# EAGLE design dabpi+_v1 (EAGLE 6.6.0)
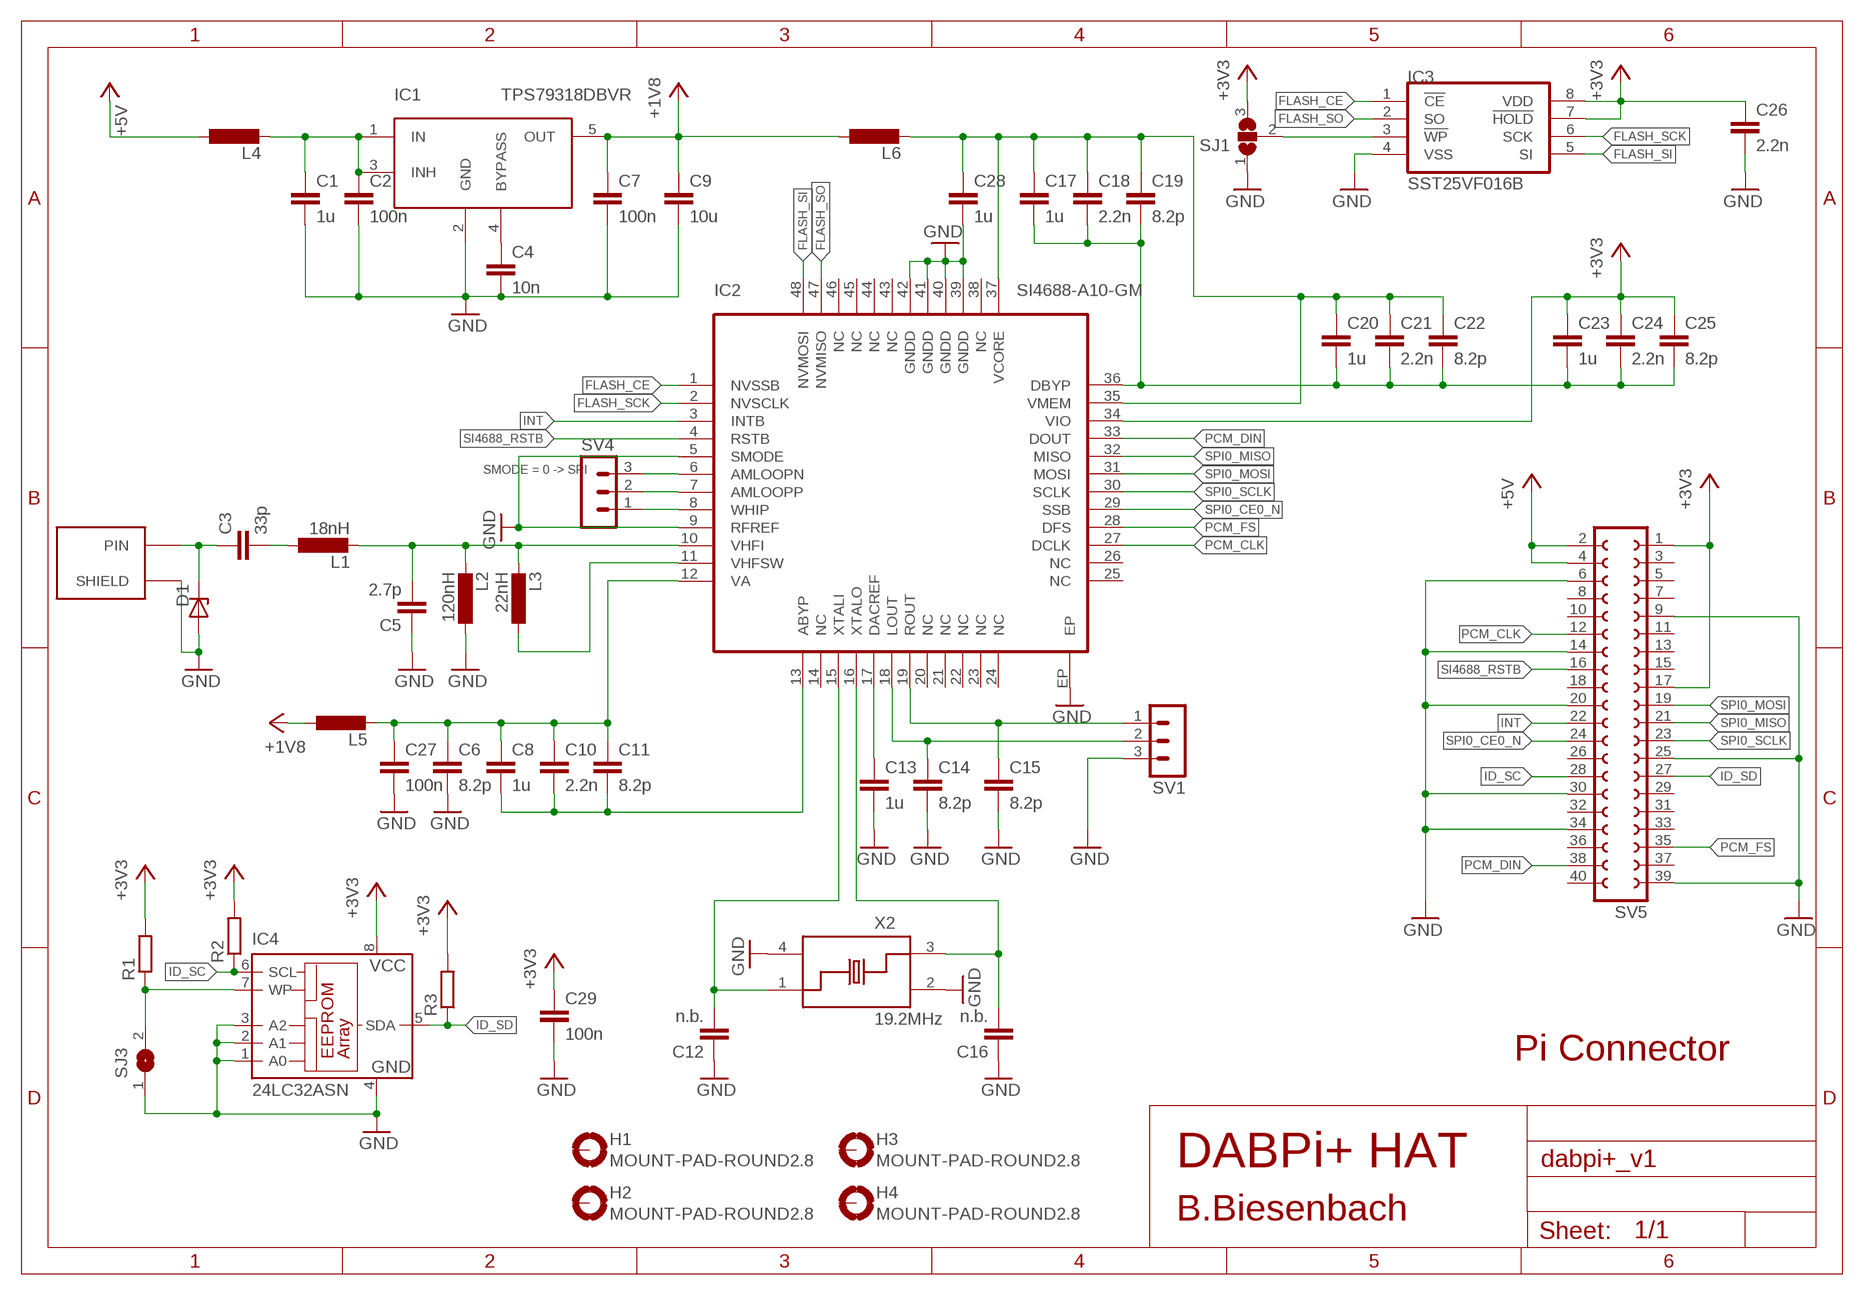
[diagram p0: schematic, sheet 1]

## Parts
C1  1u  C0603  [SMD0603]
C2  100n  C0603  [SMD0603]
C3  33p  C0402  [SMD0402]
C4  10n  C0603  [SMD0603]
C5  2.7p  C0402  [SMD0402]
C6  8.2p  C0603  [SMD0603]
C7  100n  C0603  [SMD0603]
C8  1u  C0603  [SMD0603]
C9  10u  C0603  [SMD0603]
C10  2.2n  C0603  [SMD0603]
C11  8.2p  C0603  [SMD0603]
C12  n.b.  C0402  [SMD0402]
C13  1u  C0603  [SMD0603]
C14  8.2p  C0603  [SMD0603]
C15  8.2p  C0603  [SMD0603]
C16  n.b.  C0402  [SMD0402]
C17  1u  C0603  [SMD0603]
C18  2.2n  C0603  [SMD0603]
C19  8.2p  C0603  [SMD0603]
C20  1u  C0603  [SMD0603]
C21  2.2n  C0603  [SMD0603]
C22  8.2p  C0603  [SMD0603]
C23  1u  C0603  [SMD0603]
C24  2.2n  C0603  [SMD0603]
C25  8.2p  C0603  [SMD0603]
C26  2.2n  C0603  [SMD0603]
C27  100n  C0603  [SMD0603]
C28  1u  C0603  [SMD0603]
C29  100n  C0603  [SMD0603]
D1  ESD9L5.0  [SOD923]
H1  MOUNT-PAD-ROUND2.8  [2,8-PAD]
H2  MOUNT-PAD-ROUND2.8  [2,8-PAD]
H3  MOUNT-PAD-ROUND2.8  [2,8-PAD]
H4  MOUNT-PAD-ROUND2.8  [2,8-PAD]
IC1  TPS79318DBVR  [SOT23-5]
IC2  SI4688-A10-GM  [QFN48]
IC3  SST25VF016B  [SO08]
IC4  24LC32ASN  [SO-08]
L1  18nH  L0402  [SMD0402]
L2  120nH  L0402  [SMD0402]
L3  22nH  L0402  [SMD0402]
L4  L0603  [SMD0603]
L5  L0603  [SMD0603]
L6  L0603  [SMD0603]
R1  R0603  [SMD0603]
R2  R0603  [SMD0603]
R3  R0603  [SMD0603]
SJ1  SJ2W  [SJ_2]
SJ3  SJ  [SJ]
SV1  MA03-1  [MA03-1]
SV4  MA03-1  [MA03-1]
SV5  FE20-2  [FE20-2]
X1  SMA_LP_1.57MM  [SMA_LP_1.57MM]
X2  19.2MHz  XTAL_3.2X2.5  [XTAL_3.2X2.5]

## Nets
+1V8: C7.1 C9.1 IC1.5(OUT) L5.1 L6.1
+3V3: C23.1 C24.1 C25.1 C26.1 C29.1 IC2.34(VIO) IC3.7(!HOLD) IC3.8(VDD) IC4.8(VCC) R1.2 R2.2 R3.2 SJ1.3 SV5.1 SV5.17
+5V: L4.1 SV5.2 SV5.4
FLASH_CE: IC2.1(NVSSB) IC3.1(!CE)
FLASH_SCK: IC2.2(NVSCLK) IC3.6(SCK)
FLASH_SI: IC2.48(NVMOSI) IC3.5(SI)
FLASH_SO: IC2.47(NVMISO) IC3.2(SO)
GND: C1.2 C2.2 C4.2 C5.1 C6.2 C7.2 C9.2 C12.1 C13.2 C14.2 C15.2 C16.1 C26.2 C27.2 C28.2 C29.2 D1.A IC1.2(GND) IC2.5(SMODE) IC2.9(RFREF) IC2.39(GNDD) IC2.40(GNDD) IC2.41(GNDD) IC2.42(GNDD) IC2.EP IC3.4(VSS) IC4.1(A0) IC4.2(A1) IC4.3(A2) IC4.4(GND) L2.1 SJ1.1 SJ3.1 SV1.3 SV5.6 SV5.9 SV5.14 SV5.20 SV5.25 SV5.30 SV5.34 SV5.39 X1.GND(SHIELD) X1.GND@1(SHIELD) X1.GND@2(SHIELD) X1.GND@3(SHIELD) X2.2(GND) X2.4(GND)
ID_SC: IC4.6(SCL) R2.1 SV5.28
ID_SD: IC4.5(SDA) R3.1 SV5.27
INT: IC2.3(INTB) SV5.22
LDO_IN: C1.1 C2.1 IC1.1(IN) IC1.3(INH) L4.2
N$1: C3.2 L1.1
N$2: C5.2 IC2.10(VHFI) L1.2 L2.2 L3.2
N$3: IC2.11(VHFSW) L3.1
N$4: C8.2 C10.2 C11.2 IC2.13(ABYP)
N$5: C17.2 C18.2 C19.2 C20.2 C21.2 C22.2 C23.2 C24.2 C25.2 IC2.36(DBYP)
N$6: C12.2 IC2.15(XTALI) X2.1
N$7: C16.2 IC2.16(XTALO) X2.3
N$8: C13.1 IC2.17(DACREF)
N$9: IC3.3(!WP) SJ1.2
N$11: C4.1 IC1.4(BYPASS)
N$12: C6.1 C8.1 C10.1 C11.1 C27.1 IC2.12(VA) L5.2
N$13: IC2.6(AMLOOPN) SV4.3
N$14: C17.1 C18.1 C19.1 C20.1 C21.1 C22.1 C28.1 IC2.35(VMEM) IC2.37(VCORE) L6.2
N$15: IC2.7(AMLOOPP) SV4.2
N$16: IC2.8(WHIP) SV4.1
N$18: IC4.7(WP) R1.1 SJ3.2
PCM_CLK: IC2.27(DCLK) SV5.12
PCM_DIN: IC2.33(DOUT) SV5.38
PCM_FS: IC2.28(DFS) SV5.35
RF_IN: C3.1 D1.K(C) X1.PIN
SI4688_LOUT: C14.1 IC2.18(LOUT) SV1.2
SI4688_ROUT: C15.1 IC2.19(ROUT) SV1.1
SI4688_RSTB: IC2.4(RSTB) SV5.16
SPI0_CE0_N: IC2.29(SSB) SV5.24
SPI0_MISO: IC2.32(MISO) SV5.21
SPI0_MOSI: IC2.31(MOSI) SV5.19
SPI0_SCLK: IC2.30(SCLK) SV5.23
Unconnected: H1.B2,8(MOUNT) H2.B2,8(MOUNT) H3.B2,8(MOUNT) H4.B2,8(MOUNT) IC2.14(NC) IC2.20(NC) IC2.21(NC) IC2.22(NC) IC2.23(NC) IC2.24(NC) IC2.25(NC) IC2.26(NC) IC2.38(NC) IC2.43(NC) IC2.44(NC) IC2.45(NC) IC2.46(NC) SV5.3 SV5.5 SV5.7 SV5.8 SV5.10 SV5.11 SV5.13 SV5.15 SV5.18 SV5.26 SV5.29 SV5.31 SV5.32 SV5.33 SV5.36 SV5.37 SV5.40

## Notes on the sheet
- SMODE = 0 -> SPI
- Pi Connector
- DABPi+ HAT
- B.Biesenbach

## Library data of the parts
C1 C2 C4 C6-C11 C13-C15 C17-C29 = generisch:C0603
C3 C5 C12 C16 = generisch:C0402
D1 = generisch:ESD9L5.0
H1-H4 = holes:MOUNT-PAD-ROUND: MOUNTING PAD, round
IC1 = ldo_reg:TPS79318DBVR
IC2 = SI4688-A10-GM:SI4688-A10-GM
IC3 = sst25:SST25VF016B
IC4 = microchip:24*: Serial EEPROM I2C; MF: MICROCHIP; MPN: 24LC32A/SN; OC_FARNELL: 9758003; OC_NEWARK: 33C2976
L1-L3 = generisch:L0402
L4-L6 = generisch:L0603
R1-R3 = R_C_0805:R0603
SJ1 = jumper:SJ2W: SMD solder JUMPER
SJ3 = generisch:SJ: SMD solder JUMPER
SV1 SV4 = con-lstb:MA03-1: PIN HEADER; OC_FARNELL: unknown; OC_NEWARK: unknown
SV5 = con-lsta:FE20-2: FEMALE HEADER; OC_FARNELL: unknown; OC_NEWARK: unknown
X1 = con_sma:SMA_LP_1.57MM: Abschlussbuchse SMA LP rund 1,57mm RS 526-5785
X2 = generisch:XTAL_3.2X2.5

## Board
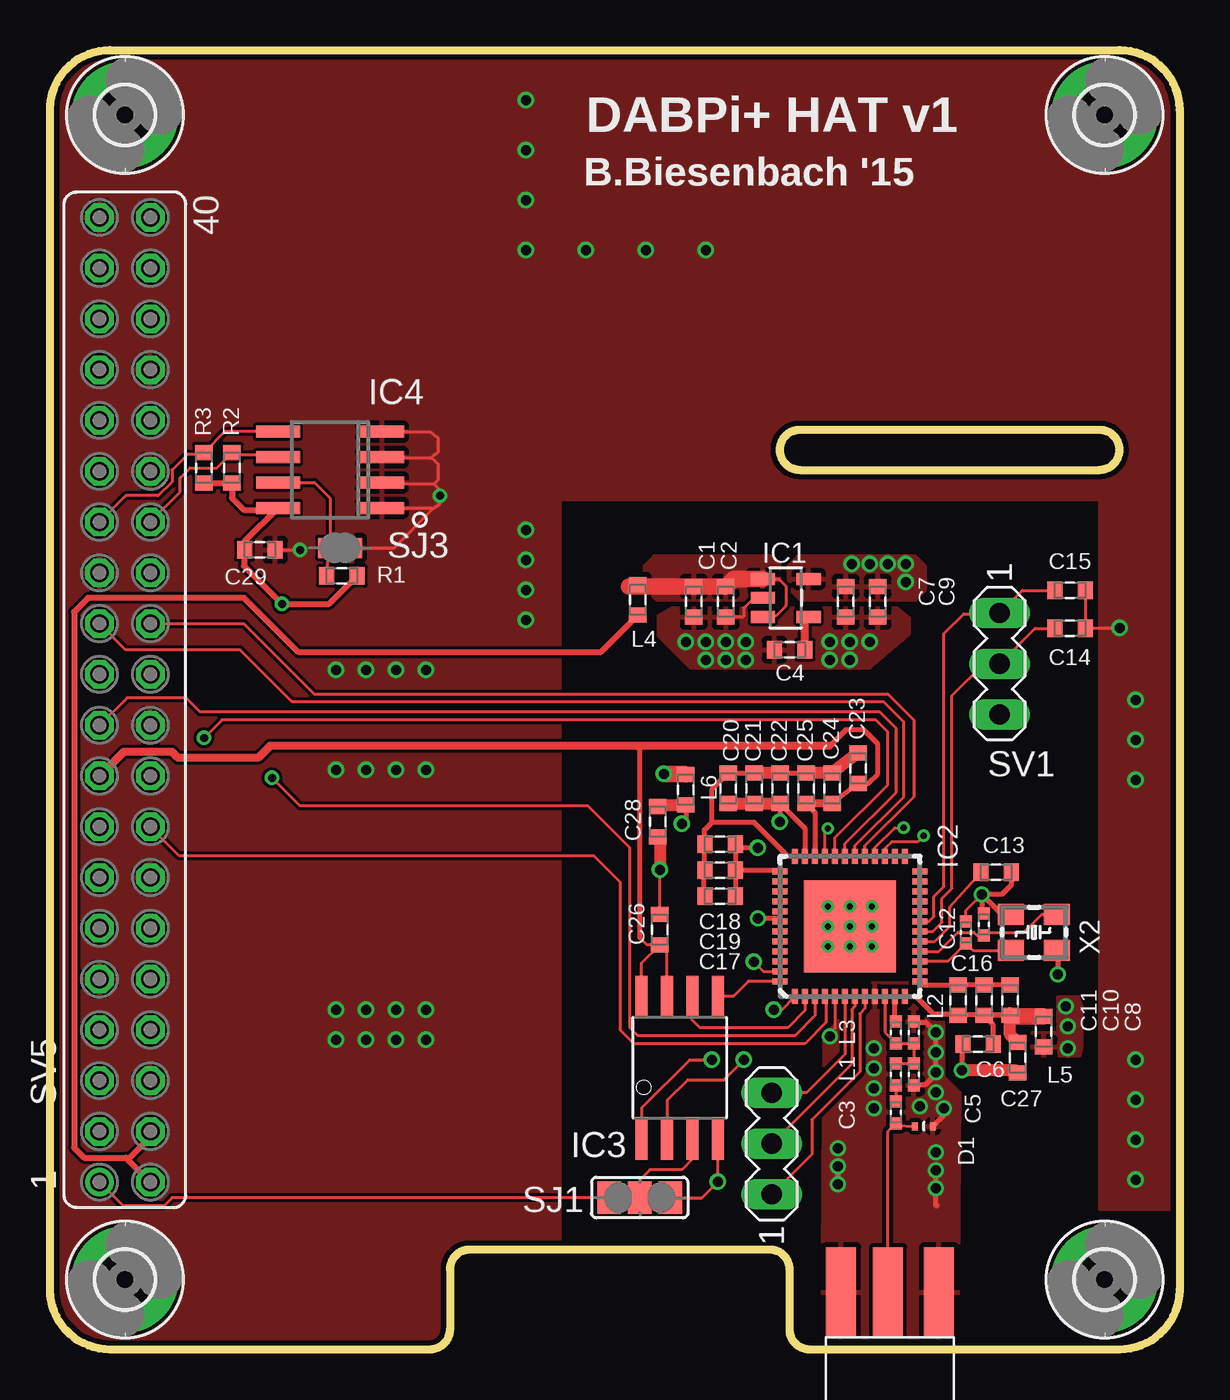
[diagram p1: board, top side]
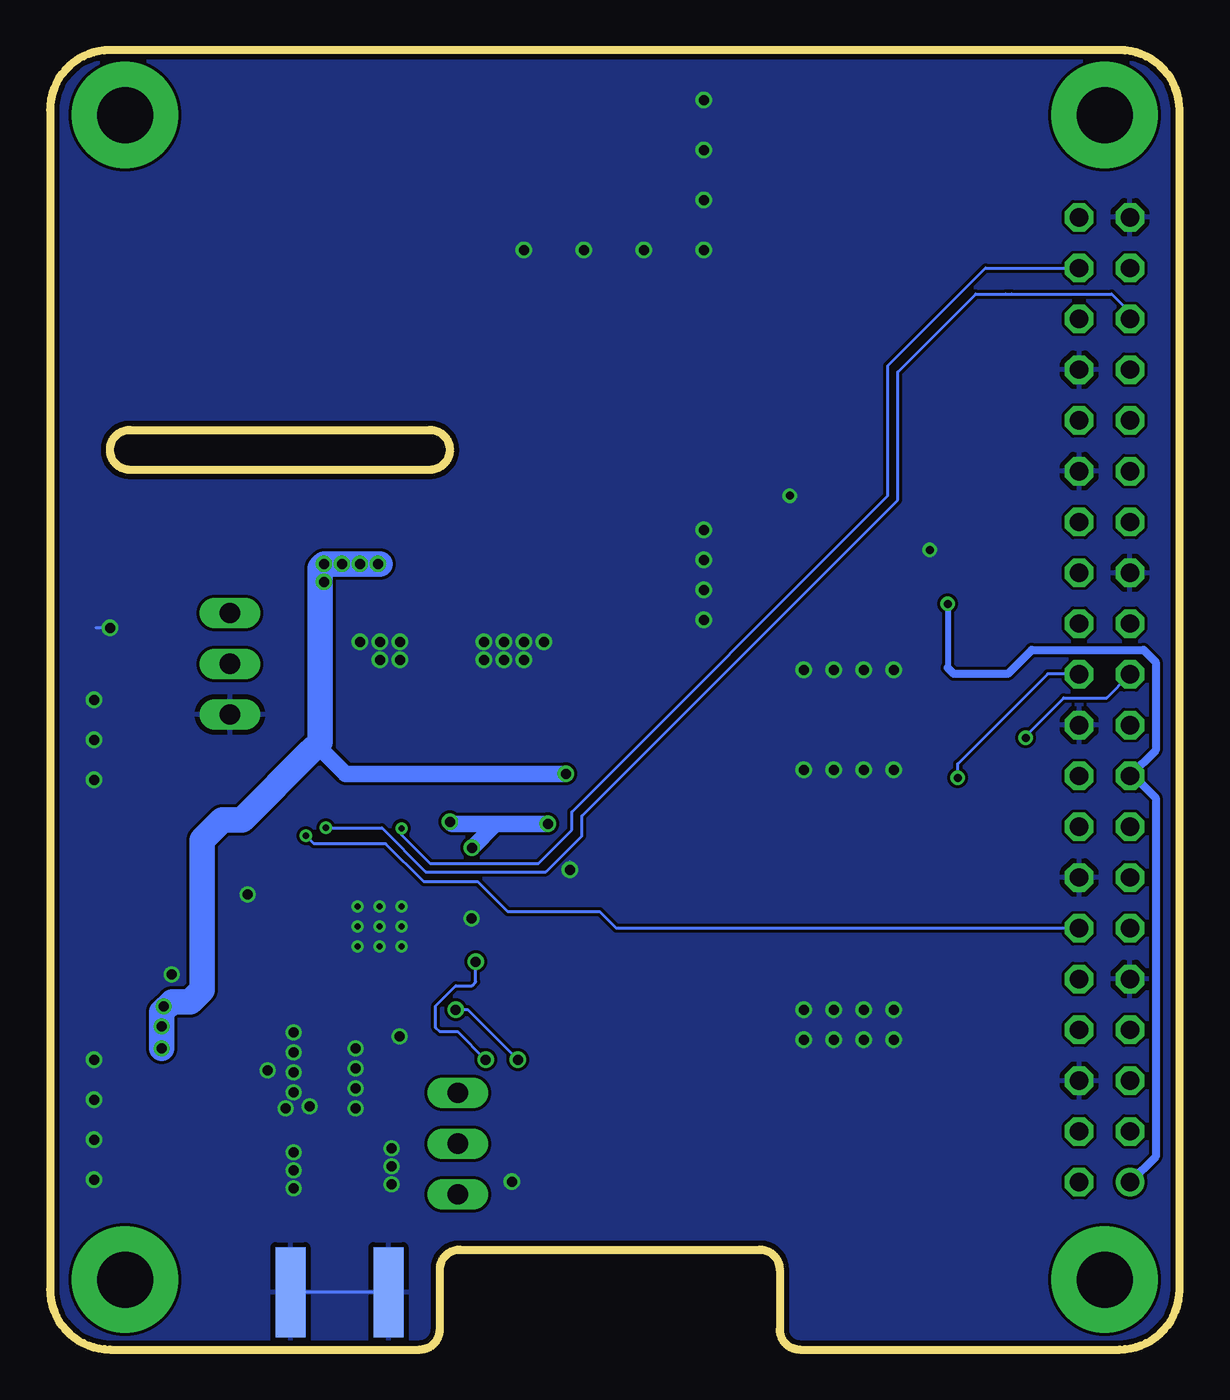
[diagram p2: board, bottom side, seen from below]

Size 56.5 x 65 mm. Coordinates in mm from the lower left corner, seen from the top.
Outline: 3,0 arc-90 0,3 0,62 arc-90 3,65 53.5,65 arc-90 56.5,62 56.5,3 arc-90 53.5,0 38,0 arc-90 37,1 37,4 arc90 36,5 21,5 arc90 20,4 20,1 arc-90 19,0 3,0
Outline: 52.5,44 arc90 53.5,45 arc90 52.5,46 37.5,46 arc90 36.5,45 arc90 37.5,44 52.5,44
Copper layers (1*16): Top 0.035mm / dielectric 1.5mm / Bottom 0.035mm
Design rules "Elecrow_2-layer_eagle_rule *": minimum track width 6mil, minimum drill 12mil, track to track 6mil, track to pad 6mil, pad to pad 6mil, via to via 6mil, smd to smd 0mil, copper to edge 10mil, drill to drill 10mil, minimum pad ring 10mil, minimum via ring 6mil, stop-mask expansion 2mil, vias tented up to drill 0mil, thermal gap 10mil

### Footprints (pad centres in the part's own frame; a part is rotated, then mirrored left to right if it is on the bottom)
SMD0603 = smd 0.762 x 0.889: 1 -0.762,0; 2 0.762,0
SMD0402 = smd 0.6 x 0.6: 1 -0.55,0; 2 0.55,0
SOD923 = smd 0.3 x 0.4: A -0.45,0; K 0.45,0
2,8-PAD = drill 2.8 pad 5.334: B2,8 0,0
SOT23-5 = smd 0.6 x 1.2: 1 -0.95,-1.15; 2 0,-1.15; 3 0.95,-1.15; 4 0.95,1.15; 5 -0.95,1.15
QFN48 = smd 0.75 x 0.3: 1 -3.5,2.75; 2 -3.5,2.25; 3 -3.5,1.75; 4 -3.5,1.25; 5 -3.5,0.75; 6 -3.5,0.25; 7 -3.5,-0.25; 8 -3.5,-0.75; 9 -3.5,-1.25; 10 -3.5,-1.75; 11 -3.5,-2.25; 12 -3.5,-2.75; 25 3.5,-2.75; 26 3.5,-2.25; 27 3.5,-1.75; 28 3.5,-1.25; 29 3.5,-0.75; 30 3.5,-0.25; 31 3.5,0.25; 32 3.5,0.75; 33 3.5,1.25; 34 3.5,1.75; 35 3.5,2.25; 36 3.5,2.75 | smd 0.3 x 0.75: 13 -2.75,-3.5; 14 -2.25,-3.5; 15 -1.75,-3.5; 16 -1.25,-3.5; 17 -0.75,-3.5; 18 -0.25,-3.5; 19 0.25,-3.5; 20 0.75,-3.5; 21 1.25,-3.5; 22 1.75,-3.5; 23 2.25,-3.5; 24 2.75,-3.5; 37 2.75,3.5; 38 2.25,3.5; 39 1.75,3.5; 40 1.25,3.5; 41 0.75,3.5; 42 0.25,3.5; 43 -0.25,3.5; 44 -0.75,3.5; 45 -1.25,3.5; 46 -1.75,3.5; 47 -2.25,3.5; 48 -2.75,3.5 | smd 4.6 x 4.6: EP 0,0
SO08 = smd 0.61 x 2: 1 -1.905,-3.6; 2 -0.635,-3.6; 3 0.635,-3.6; 4 1.905,-3.6; 5 1.905,3.6; 6 0.635,3.6; 7 -0.635,3.6; 8 -1.905,3.6
SO-08 = smd 0.6 x 2.2: 1 -1.905,-2.6; 2 -0.635,-2.6; 3 0.635,-2.6; 4 1.905,-2.6; 5 1.905,2.6; 6 0.635,2.6; 7 -0.635,2.6; 8 -1.905,2.6
SJ_2 = smd 1.168 x 1.6: 1 -1.524,0; 2 0,0; 3 1.524,0
SJ = smd 1 x 1: 1 -0.6,0; 2 0.6,0
MA03-1 = drill 1.016 long: 1 -2.54,0; 2 0,0; 3 2.54,0
FE20-2 = drill 0.914: 1 -24.13,1.27 | drill 0.914 octagon: 2 -24.13,-1.27; 3 -21.59,1.27; 4 -21.59,-1.27; 5 -19.05,1.27; 6 -19.05,-1.27; 7 -16.51,1.27; 8 -16.51,-1.27; 9 -13.97,1.27; 10 -13.97,-1.27; 11 -11.43,1.27; 12 -11.43,-1.27; 13 -8.89,1.27; 14 -8.89,-1.27; 15 -6.35,1.27; 16 -6.35,-1.27; 17 -3.81,1.27; 18 -3.81,-1.27; 19 -1.27,1.27; 20 -1.27,-1.27; 21 1.27,1.27; 22 1.27,-1.27; 23 3.81,1.27; 24 3.81,-1.27; 25 6.35,1.27; 26 6.35,-1.27; 27 8.89,1.27; 28 8.89,-1.27; 29 11.43,1.27; 30 11.43,-1.27; 31 13.97,1.27; 32 13.97,-1.27; 33 16.51,1.27; 34 16.51,-1.27; 35 19.05,1.27; 36 19.05,-1.27; 37 21.59,1.27; 38 21.59,-1.27; 39 24.13,1.27; 40 24.13,-1.27
SMA_LP_1.57MM = smd 4.5 x 1.5: GND 7,2.45; GND@2 7,-2.45; PIN 7,0.1 | smd 4.5 x 1.5 bottom: GND@1 7,-2.45; GND@3 7,2.45
XTAL_3.2X2.5 = smd 1.3 x 1.05: 1 -1.15,-0.9; 2 1.15,-0.9; 3 1.15,0.9; 4 -1.15,0.9

### Placement (x,y rotation side)
C1  32.2,37.4 270 top
C2  33.8,37.4 270 top
C3  42.32,11.87 90 top
C4  37,35 180 top
C5  43.22,13.77 90 top
C6  46.42,15.27 180 top
C7  39.8,37.4 270 top
C8  48.02,17.47 90 top
C9  41.4,37.4 270 top
C10  46.72,17.47 90 top
C11  45.42,17.47 90 top
C12  45.82,20.87 270 top
C13  47.32,23.87 0 top
C14  51.02,36.07 0 top
C15  51.02,37.97 0 top
C16  46.72,21.27 270 top
C17  33.52,22.67 180 top
C18  33.52,25.27 180 top
C19  33.52,23.97 180 top
C20  33.92,28.07 90 top
C21  35.22,28.07 90 top
C22  36.52,28.07 90 top
C23  40.42,29.07 90 top
C24  39.12,28.07 90 top
C25  37.82,28.07 90 top
C26  30.5,21 90 top
C27  48.4,14.6 270 top
C28  30.4,26.4 270 top
C29  10.5,40 0 top
D1  43.72,11.17 180 top
H1  3.75,3.5 0 top
H2  3.75,61.75 0 top
H3  52.75,61.75 0 top
H4  52.75,3.5 0 top
IC1  36.8,37.6 270 top
IC2  40.02,21.17 90 top
IC3  31.5,14.1 0 top
IC4  14,44 90 top
L1  42.32,13.77 90 top
L2  43.22,15.87 270 top
L3  42.32,15.87 270 top
L4  29.4,37.5 90 top
L5  49.7,15.9 90 top
L6  31.8,28 270 top
R1  14.6,38.7 0 top
R2  9.1,44.1 270 top
R3  7.7,44.1 270 top
SJ1  29.5,7.6 180 top
SJ3  14.5,40.1 180 top
SV1  47.5,34.3 270 top
SV4  36.1,10.3 90 top
SV5  3.75,32.5 90 top
X1  42.02,-4.13 90 top
X2  49.22,20.87 0 top

### Tracks (layer width: path | path; a pad name or v marks a point on that pad's centre or on a via)
+1V8  (via drill 0.5)
  Top 0.813: L6.1 31.76,28.8 v30.7,28.8
  Bottom 0.813: v30.7,28.8 41.7,28.8 43.2,30.3 43.2,30.2 43.45,29.95
  Bottom 1.27: v50.92,15.07 50.92,16.88 50.4,17.4 49.5,17.4 48.9,18 48.9,25.5 47.9,26.5 46.9,26.5 43.45,29.95 43,30.4 43,39.1 v42.8,39.3 40,39.3
  other vias: 50.82,17.17 40.1,39.3 41,39.3 41.9,39.3 42.8,38.4 50.92,16.17
  pour Top (isolate 0.2): 51.62,17.17 51.62,15.17 51.52,14.67 48.82,14.67 48.82,15.87 50.42,15.87 50.42,17.67 51.42,17.67
  pour Top: 37.5,37.5 43.3,37.5 43.8,38 43.8,39.2 43.3,39.7 37.4,39.7 36.9,39.2 36.9,38.1
+3V3  (via drill 0.4)
  Top 0.152: C26.1 30.39,20.13 | C26.1 29.86,20.24 29.5,20.6 | IC3.7 30.86,19.87 C26.1 | IC3.8 29.59,19.33 C26.1 | SJ1.3 6.1,7.6 5.7,7.2 3.65,7.2 SV5.1 | 9.7,39.96 C29.1
  Top 0.254: C24.1 C23.1 40.91,28.31 41.4,28.8 41.4,30.3 40.7,31 39.8,31 39,30.2 | C25.1 38.27,26.86 IC2.34 | 29.5,20.6 29.5,30 29.3,30.2 | 30.5,20.2 C26.1
  Top 0.305: 9.7,39.96 9.7,39.2 v11.6,37.3 13.96,37.3 R1.2 | C29.1 9.74,40.43 IC4.8 11.3,42 9.7,42 9.1,42.6 R2.2 R3.2
  Top 0.406: C24.1 C25.1 | C23.1 40.56,28.31 | 39,30.2 29.3,30.2 11,30.2 10.4,29.6 6.4,29.6 6.1,29.9 3.69,29.9 SV5.17
  Bottom 0.305: v11.6,37.3 11.6,34.1
  Bottom 0.406: SV5.1 1.2,9.65 1.2,27.6 2.29,28.69 SV5.17 1.2,29.97 1.2,34.4 1.8,35 7.4,35 8.6,33.8 11.3,33.8 11.6,34.1
+5V
  Top 0.305: 3.9,9.49 3.79,9.6 1.7,9.6 1.2,10.1 1.2,36.9 1.9,37.6 9.7,37.6 12.4,34.9 27.56,34.9 L4.1 | 3.9,9.49 SV5.2 | SV5.4 5.02,10.62 3.9,9.49
FLASH_CE  (via drill 0.5)
  Top 0.152: v36.2,17 36.6,17 IC2.1 | IC3.1 29.59,12.1 32,14.5 v33.1,14.5
  Bottom 0.152: 36.3,16.9 v36.2,17 35.6,17 v33.1,14.5
FLASH_SCK
  Top 0.152: IC2.2 37.77,16.97 36.9,16.1 32.5,16.1 32.1,16.5 32.1,17.66 IC3.6
FLASH_SI
  Top 0.152: IC2.48 34.92,18.42 34.2,17.7 IC3.5
FLASH_SO  (via drill 0.5)
  Top 0.152: v35.2,19.4 35.68,18.92 IC2.47 | IC3.2 30.86,12.46 31.9,13.5 33.7,13.5 v34.7,14.5
  Bottom 0.152: v34.7,14.5 36.1,15.9 37,15.9 37.2,16.1 37.2,17.2 36.2,18.2 35.4,18.2 35.2,18.4 v35.2,19.4
GND  (via drill 0.3, 0.3 pad 0.3, 0.4, 0.5)
  Top 0.152: C16.1 46.77,21.77 | 40.12,22.97 IC2.EP | C12.1 45.82,21.97 v46.62,22.77 | IC1.2 35.2,37.6 34.7,37.1 34.7,36.7 34.64,36.64 C2.2 | C15.2 C14.2 51.81,36.1 v53.5,36.1 | v30.5,24 C26.2 30.56,21.7 | IC2.5 39.27,16.07 | SJ1.1 32.6,7.6 v33.4,8.4 IC3.4 33.5,10.4 | IC4.4 19,45.91 19.4,45.6 19.4,44.9 19,44.6 | 19,44.6 16.64,44.6 IC4.3 | IC4.1 19.2,42.09 | 19.2,42.09 19.5,42.3 v19.5,42.7 19.5,43 19.2,43.3 | 19.2,43.3 16.66,43.3 IC4.2 | 19,44.6 19.1,44.6 19.4,44.3 19.4,43.5 19.2,43.3 | C29.2 v12.5,40 | SJ3.1 17.2,40.1 19.2,42.09
  Top 0.254: IC2.39 IC2.40 IC2.41 IC2.42 36.37,21.57 v35.42,21.57 | L2.1 43.27,16.37 43.82,16.37 v44.32,15.87 44.32,13.77 43.82,13.27 43.27,13.27 C5.1 | D1.A 44.72,11.72 v44.72,12.07 | C6.2 45.62,15.23 v45.62,13.97 | X2.2 50.42,19.92 v50.42,18.77 | IC2.EP 40.02,22.87 40.12,22.97 | v39.42,8.27 v39.42,9.17 39.42,8.42 | 39.47,10.02 v39.42,10.07 | 44.37,8.92 v44.32,8.97 44.32,7.17 44.37,7.22 | 44.37,9.82 v44.32,9.87 | v46.62,22.77 46.62,21.82 C16.1 | C13.2 48.08,23.23 47.62,22.77 v46.62,22.77 | X2.4 47.62,21.77 v46.62,22.77
  Top 0.61: C27.2 48.27,13.97 v45.62,13.97 | C28.2 30.5,25.54 v30.5,24
  Bottom 0.152: v53.5,36.1 54.2,36.1 | v30.5,24 30.5,24.4 | 39.29,10.2 v39.42,10.07 | X1.GND X1.GND@2
  other vias: 41.12,21.17 41.12,22.17 41.12,20.17 40.02,22.17 40.02,20.17 38.92,21.17 38.92,22.17 40.02,21.17 44.32,8.07 41.22,12.07 41.22,13.07 41.22,14.07 41.22,15.07 43.52,12.17 44.32,14.87 44.32,13.87 44.32,12.87 38.92,20.17 31.8,35.4 32.8,35.4 33.8,35.4 34.8,35.4 34.8,34.5 33.8,34.5 32.8,34.5 39,35.4 40,35.4 41,35.4 39,34.5 40,34.5 39.02,15.67 14.3,34 15.8,34 17.3,34 18.8,34 14.3,29 15.8,29 17.3,29 18.8,29 14.3,17 15.8,17 17.3,17 18.8,17 18.8,15.5 17.3,15.5 15.8,15.5 14.3,15.5 23.8,62.5 23.8,60 23.8,57.5 23.8,55 26.8,55 29.8,55 32.8,55 23.8,36.5 23.8,38 23.8,39.5 23.8,41 54.3,8.5 54.3,10.5 54.3,12.5 54.3,14.5 54.3,28.5 54.3,30.5 54.3,32.5
  pour Top (isolate 0.2): 38.62,0.57 38.72,15.67 41.12,18.37 43.22,18.37 44.72,16.87 44.72,13.67 45.52,12.87 45.42,0.57
  pour Bottom (rank 2): 0,-0.1 56.6,-0.1 56.6,64.9 0,64.9
  pour Top: 30.4,36.7 30.4,35.7 32,34.1 41,34.1 43,35.8 43,36.6 42.4,37.1 31.1,37.1
  pour Top: 0,0 0,65 56.5,65 56.5,42.5 50,42.5 25.5,42.5 25.5,5 20,5 20,0 0.5,0
  pour Top: 56.5,7 52.5,7 52.5,42.5 56.5,42.5
ID_SC
  Top 0.152: IC4.6 11.3,44.74 9.22,44.74 R2.1 8.34,44.1 7,44.1 6.5,43.6 6.5,42.9 5.02,41.42 SV5.28
ID_SD
  Top 0.152: SV5.27 3.79,42.7 5.4,42.7 6.1,43.4 6.1,44 6.9,44.8 7.64,44.8 R3.1 8.74,45.91 IC4.5
INT  (via drill 0.4)
  Top 0.152: IC2.3 38.27,16.72 37.25,15.7 29.4,15.7 29,16.1 29,25.1 26.9,27.2 12.5,27.2 v11.1,28.6
  Bottom 0.152: v11.1,28.6 11.1,29.3 6.6,33.8 5.05,33.8 SV5.22
LDO_IN
  Top 0.152: IC1.1 36.45,38.55 36.8,38.2 36.8,37.2 36.3,36.7 35.7,36.7 IC1.3
  Top 0.813: 28.96,38.16 C2.1 34.19,38.55 IC1.1
  pour Top: 30.3,37.5 36.1,37.5 36.5,37.9 36.5,39.3 36.1,39.7 30.2,39.7 29.7,39.2 29.7,38.1
N$1
  Top 0.152: L1.1 C3.2
N$2
  Top 0.152: IC2.10 41.77,15.87 L3.2 L2.2 C5.2 L1.2
N$3
  Top 0.254: L3.1 42.27,16.47 IC2.11
N$4
  Top 0.254: IC2.13 43.71,18.23 C11.2 C10.2 C8.2
N$5
  Top 0.254: IC2.36 36.92,24.67 35.22,26.37 33.12,26.37 | 33.12,26.37 32.72,25.97 32.72,25.77 | 32.72,25.77 32.72,23.93 | C17.2 32.72,22.71 32.72,23.93 | 33.12,26.37 33.12,28.03 C20.2 C21.2 | C22.2 C25.2 | 32.72,23.93 C19.2 | C18.2 32.76,25.73 32.72,25.77
  Top 0.61: C23.2 C24.2 C25.2 | C22.2 C21.2
N$6
  Top 0.152: X2.1 46.17,19.97 C12.2 44.92,19.42 IC2.15
N$7
  Top 0.152: IC2.16 44.47,19.92 45.42,20.87 46.22,20.87 46.37,20.72 C16.2 46.87,20.87 48.72,20.87 49.62,21.77 X2.3
N$8
  Top 0.152: IC2.17 44.27,20.42 45.02,21.17 45.02,22.13 C13.1
N$9
  Top 0.152: IC3.3 32.13,9.54 31.6,9 30,9 29.5,8.5 SJ1.2
N$11
  Top 0.406: C4.1 37.76,36.46 IC1.4
N$12
  Top 0.254: IC2.12 43.32,17.67 44.22,16.77 45.36,16.77 | 45.36,16.77 47.96,16.77 | 47.96,16.77 C8.1 | C6.1 47.18,16.25 C10.1 47.9,16.71 47.96,16.77 | C11.1 45.36,16.77
  Top 0.61: C27.1 48.02,15.74 C8.1
  Top 0.813: L5.2 48.07,16.66 C8.1
N$13
  Top 0.152: IC2.6 39.77,14.77 37.84,12.84 SV4.3
N$14  (via drill 0.5)
  Top 0.254: IC2.35 37.77,26.06 C22.1 36.52,26.42 v36.5,26.4 | C19.1 C18.1 34.45,25.1 v35.4,25.1 | C19.1 C17.1 | IC2.37 36.47,23.97 C19.1 | L6.2 31.8,26.5 v31.6,26.3
  Top 0.406: 35.58,27.31 C21.1
  Top 0.61: C20.1 C21.1 C22.1 | C28.1 30.48,27.24 L6.2
  Bottom 0.813: v31.6,26.3 34.2,26.3 | 34.2,26.3 v35.4,25.1 | v36.5,26.4 36.4,26.3 34.2,26.3
N$15
  Top 0.152: 36.4,10.3 SV4.2 40.1,14.3 40.1,17 40.27,17.17 IC2.7
N$16
  Top 0.152: IC2.8 40.77,17.07 40.5,16.8 40.5,13.9 38.1,11.5 38.1,9.76 SV4.1
N$18
  Top 0.152: R1.1 SJ3.2 14,40.2 14,42.6 13.23,43.37 IC4.7
PCM_CLK  (via drill 0.3)
  Top 0.152: v43.7,25.7 43.4,25.4 42.1,25.4 41.77,25.07 IC2.27
  Bottom 0.152: v43.7,25.7 43.3,25.3 39.7,25.3 37.8,23.4 35.1,23.4 33.6,21.9 29,21.9 28.17,21.07 SV5.12
PCM_DIN  (via drill 0.3)
  Top 0.152: IC2.33 38.77,25.92 v38.92,26.07
  Bottom 0.152: v38.92,26.07 38.92,25.75 37.47,24.3 32.1,24.3 30.4,26 30.4,26.9 14.6,42.7 14.6,49.2 9.71,54.09 SV5.38
PCM_FS  (via drill 0.3)
  Top 0.152: v42.7,26.1 42.25,26.1 41.27,25.12 IC2.28
  Bottom 0.152: v42.7,26.1 39.9,26.1 37.7,23.9 31.7,23.9 29.9,25.7 29.9,26.7 14.1,42.5 14.1,48.9 10.2,52.8 8.7,52.8 8.4,52.8 3.4,52.8 2.48,51.88 SV5.35
RF_IN
  Top 0.152: C3.1 42.32,11.22 D1.K | C3.1 42.32,11.27 | X1.PIN 41.92,10.92 C3.1
SI4688_LOUT
  Top 0.152: IC2.18 44.17,20.92 44.62,21.37 44.62,22.57 45.12,23.07 45.12,32.72 46.7,34.3 SV1.2 49.27,36.07 C14.1
SI4688_ROUT
  Top 0.152: IC2.19 43.97,21.42 44.22,21.67 44.22,22.67 44.72,23.17 44.72,35.82 45.7,36.8 46.66,36.8 SV1.1 48.63,37.97 C15.1
SI4688_RSTB
  Top 0.152: IC2.4 38.82,17.62 38.82,16.37 37.75,15.3 29.2,15.3 28.5,16 28.5,23.4 27.2,24.7 6.47,24.7 SV5.16
SPI0_CE0_N
  Top 0.152: IC2.29 40.77,25.22 43.2,27.65 43.2,31.5 41.9,32.8 13.2,32.8 9.7,36.3 SV5.24
SPI0_MISO  (via drill 0.4)
  Top 0.152: IC2.32 39.27,25.62 41.9,28.25 41.9,30.9 41.3,31.5 8.6,31.5 v7.7,30.6
  Bottom 0.152: v7.7,30.6 7.7,30.7 5.8,32.6 3.65,32.6 SV5.21
SPI0_MOSI
  Top 0.152: IC2.31 39.77,25.32 42.3,27.85 42.3,31.1 41.5,31.9 7.5,31.9 6.8,32.6 3.85,32.6 SV5.19
SPI0_SCLK
  Top 0.152: IC2.30 40.27,25.22 42.7,27.65 42.7,31.4 41.7,32.4 12.1,32.4 9.5,35 3.79,35 SV5.23

### Text on the board
tPlace: DABPi+ HAT v1 | B.Biesenbach '15